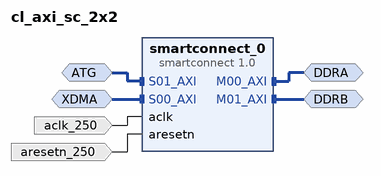
[diagram p0: block diagram of the top level]
# Vivado block design cl_axi_sc_2x2, xcvu47p-fsvh2892-2-e, Vivado 2025.2
create_bd_design cl_axi_sc_2x2

create_bd_intf_port -mode Slave -vlnv xilinx.com:interface:aximm_rtl:1.0 ATG
set_property -dict [list \
  CONFIG.ADDR_WIDTH 64 \
  CONFIG.ARUSER_WIDTH 0 \
  CONFIG.AWUSER_WIDTH 0 \
  CONFIG.BUSER_WIDTH 0 \
  CONFIG.DATA_WIDTH 512 \
  CONFIG.FREQ_HZ 250000000 \
  CONFIG.HAS_BRESP 1 \
  CONFIG.HAS_BURST 0 \
  CONFIG.HAS_CACHE 1 \
  CONFIG.HAS_LOCK 0 \
  CONFIG.HAS_PROT 0 \
  CONFIG.HAS_QOS 0 \
  CONFIG.HAS_REGION 0 \
  CONFIG.HAS_RRESP 1 \
  CONFIG.HAS_WSTRB 1 \
  CONFIG.ID_WIDTH 16 \
  CONFIG.MAX_BURST_LENGTH 64 \
  CONFIG.NUM_READ_OUTSTANDING 32 \
  CONFIG.NUM_READ_THREADS 1 \
  CONFIG.NUM_WRITE_OUTSTANDING 32 \
  CONFIG.NUM_WRITE_THREADS 1 \
  CONFIG.PROTOCOL AXI4 \
  CONFIG.READ_WRITE_MODE READ_WRITE \
  CONFIG.RUSER_BITS_PER_BYTE 0 \
  CONFIG.RUSER_WIDTH 0 \
  CONFIG.SUPPORTS_NARROW_BURST 0 \
  CONFIG.WUSER_BITS_PER_BYTE 0 \
  CONFIG.WUSER_WIDTH 0 \
] [get_bd_intf_ports ATG]
create_bd_intf_port -mode Master -vlnv xilinx.com:interface:aximm_rtl:1.0 DDRA
set_property -dict [list \
  CONFIG.ADDR_WIDTH 64 \
  CONFIG.DATA_WIDTH 512 \
  CONFIG.FREQ_HZ 250000000 \
  CONFIG.HAS_BURST 0 \
  CONFIG.HAS_LOCK 0 \
  CONFIG.HAS_PROT 0 \
  CONFIG.HAS_QOS 0 \
  CONFIG.NUM_READ_OUTSTANDING 16 \
  CONFIG.NUM_WRITE_OUTSTANDING 16 \
  CONFIG.PROTOCOL AXI4 \
] [get_bd_intf_ports DDRA]
create_bd_intf_port -mode Master -vlnv xilinx.com:interface:aximm_rtl:1.0 DDRB
set_property -dict [list \
  CONFIG.ADDR_WIDTH 64 \
  CONFIG.DATA_WIDTH 512 \
  CONFIG.FREQ_HZ 250000000 \
  CONFIG.HAS_BURST 0 \
  CONFIG.HAS_LOCK 0 \
  CONFIG.HAS_PROT 0 \
  CONFIG.HAS_QOS 0 \
  CONFIG.NUM_READ_OUTSTANDING 32 \
  CONFIG.NUM_WRITE_OUTSTANDING 32 \
  CONFIG.PROTOCOL AXI4 \
] [get_bd_intf_ports DDRB]
create_bd_intf_port -mode Slave -vlnv xilinx.com:interface:aximm_rtl:1.0 XDMA
set_property -dict [list \
  CONFIG.ADDR_WIDTH 64 \
  CONFIG.ARUSER_WIDTH 0 \
  CONFIG.AWUSER_WIDTH 0 \
  CONFIG.BUSER_WIDTH 0 \
  CONFIG.DATA_WIDTH 512 \
  CONFIG.FREQ_HZ 250000000 \
  CONFIG.HAS_BRESP 1 \
  CONFIG.HAS_BURST 0 \
  CONFIG.HAS_CACHE 1 \
  CONFIG.HAS_LOCK 0 \
  CONFIG.HAS_PROT 0 \
  CONFIG.HAS_QOS 0 \
  CONFIG.HAS_REGION 0 \
  CONFIG.HAS_RRESP 1 \
  CONFIG.HAS_WSTRB 1 \
  CONFIG.ID_WIDTH 16 \
  CONFIG.MAX_BURST_LENGTH 64 \
  CONFIG.NUM_READ_OUTSTANDING 64 \
  CONFIG.NUM_READ_THREADS 4 \
  CONFIG.NUM_WRITE_OUTSTANDING 32 \
  CONFIG.NUM_WRITE_THREADS 4 \
  CONFIG.PROTOCOL AXI4 \
  CONFIG.READ_WRITE_MODE READ_WRITE \
  CONFIG.RUSER_BITS_PER_BYTE 0 \
  CONFIG.RUSER_WIDTH 0 \
  CONFIG.SUPPORTS_NARROW_BURST 0 \
  CONFIG.WUSER_BITS_PER_BYTE 0 \
  CONFIG.WUSER_WIDTH 0 \
] [get_bd_intf_ports XDMA]
create_bd_port -dir I -type clk aclk_250
set_property -dict [list \
  CONFIG.ASSOCIATED_BUSIF DDRA:XDMA:ATG:DDRB \
  CONFIG.ASSOCIATED_RESET aresetn_250 \
  CONFIG.FREQ_HZ 250000000 \
] [get_bd_ports aclk_250]
create_bd_port -dir I -type rst aresetn_250

create_bd_cell -type ip -vlnv xilinx.com:ip:smartconnect:1.0 smartconnect_0
set_property -dict [list \
  CONFIG.ADVANCED_PROPERTIES { __view__ { functional { S01_Entry { PKT_R_THR 512 PKT_W_THR 64 } S00_Buffer { R_SIZE 512 W_SIZE 512 } S01_Buffer { R_SIZE 512 W_SIZE 512 } S00_Entry { PKT_R_THR 512 PKT_W_THR 64 } } }} \
  CONFIG.NUM_CLKS 1 \
  CONFIG.NUM_MI 2 \
  CONFIG.NUM_SI 2 \
] [get_bd_cells smartconnect_0]

# ---- connections ----

connect_bd_intf_net [get_bd_intf_ports ATG] [get_bd_intf_pins smartconnect_0/S01_AXI]
connect_bd_intf_net [get_bd_intf_ports XDMA] [get_bd_intf_pins smartconnect_0/S00_AXI]
connect_bd_intf_net [get_bd_intf_ports DDRA] [get_bd_intf_pins smartconnect_0/M00_AXI]
connect_bd_intf_net [get_bd_intf_ports DDRB] [get_bd_intf_pins smartconnect_0/M01_AXI]
connect_bd_net -net aclk_0_1 [get_bd_ports aclk_250] [get_bd_pins smartconnect_0/aclk]
connect_bd_net -net aresetn_0_1 [get_bd_ports aresetn_250] [get_bd_pins smartconnect_0/aresetn]

# ---- address map ----
assign_bd_address -offset 0x0000000000000000 -range 64G -target_address_space [get_bd_addr_spaces ATG] [get_bd_addr_segs DDRA/Reg]
assign_bd_address -offset 0x0000001000000000 -range 64G -target_address_space [get_bd_addr_spaces ATG] [get_bd_addr_segs DDRB/Reg]
assign_bd_address -offset 0x0000000000000000 -range 64G -target_address_space [get_bd_addr_spaces XDMA] [get_bd_addr_segs DDRA/Reg]
assign_bd_address -offset 0x0000001000000000 -range 64G -target_address_space [get_bd_addr_spaces XDMA] [get_bd_addr_segs DDRB/Reg]

validate_bd_design
save_bd_design
